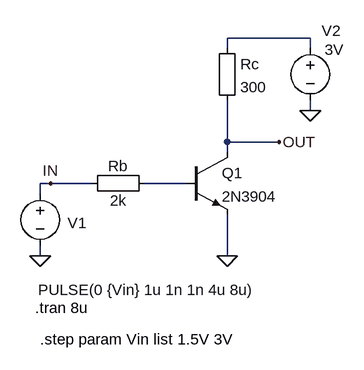
[diagram p0: schematic BT-CE-SWITCH-VIN.asc]
BT-CE-SWITCH-VIN.asc, the LTspice schematic file:
Version 4
SHEET 1 880 680
WIRE 336 -96 208 -96
WIRE 208 -80 208 -96
WIRE 336 -80 336 -96
WIRE 336 16 336 0
WIRE 208 64 208 0
WIRE 288 64 208 64
WIRE 208 80 208 64
WIRE -64 128 -80 128
WIRE 0 128 -64 128
WIRE 144 128 80 128
WIRE -80 144 -80 128
WIRE -80 240 -80 224
WIRE 208 240 208 176
FLAG 208 240 0
FLAG -80 240 0
FLAG 336 16 0
FLAG -64 128 IN
FLAG 288 64 OUT
SYMBOL Misc\\EuropeanResistor 192 -96 R0
SYMATTR InstName Rc
SYMATTR Value 300
SYMBOL Misc\\EuropeanResistor 96 112 R90
WINDOW 0 5 56 VBottom 2
WINDOW 3 27 56 VTop 2
SYMATTR InstName Rb
SYMATTR Value 2k
SYMBOL voltage -80 128 R0
WINDOW 3 -3 164 Left 2
WINDOW 123 0 0 Left 2
WINDOW 39 0 0 Left 2
WINDOW 0 42 61 Left 2
SYMATTR Value PULSE(0 {Vin} 1u 1n 1n 4u 8u)
SYMATTR InstName V1
SYMBOL voltage 336 -96 R0
WINDOW 3 22 18 Left 2
WINDOW 123 0 0 Left 2
WINDOW 39 0 0 Left 2
WINDOW 0 18 -11 Left 2
SYMATTR Value 3V
SYMATTR InstName V2
SYMBOL npn 144 80 R0
SYMATTR InstName Q1
SYMATTR Value 2N3904
TEXT -88 320 Left 2 !.tran 8u
TEXT -80 368 Left 2 !.step param Vin list 1.5V 3V

The netlist it stands for:
* BT-CE-SWITCH-VIN.asc
Rc N001 OUT 300
Rb N002 IN 2k
V1 IN 0 PULSE(0 {Vin} 1u 1n 1n 4u 8u)
V2 N001 0 3V
Q1 OUT N002 0 0 2N3904
.model NPN NPN
.model PNP PNP
.lib standard.bjt
.tran 8u
.step param Vin list 1.5V 3V
.backanno
.end